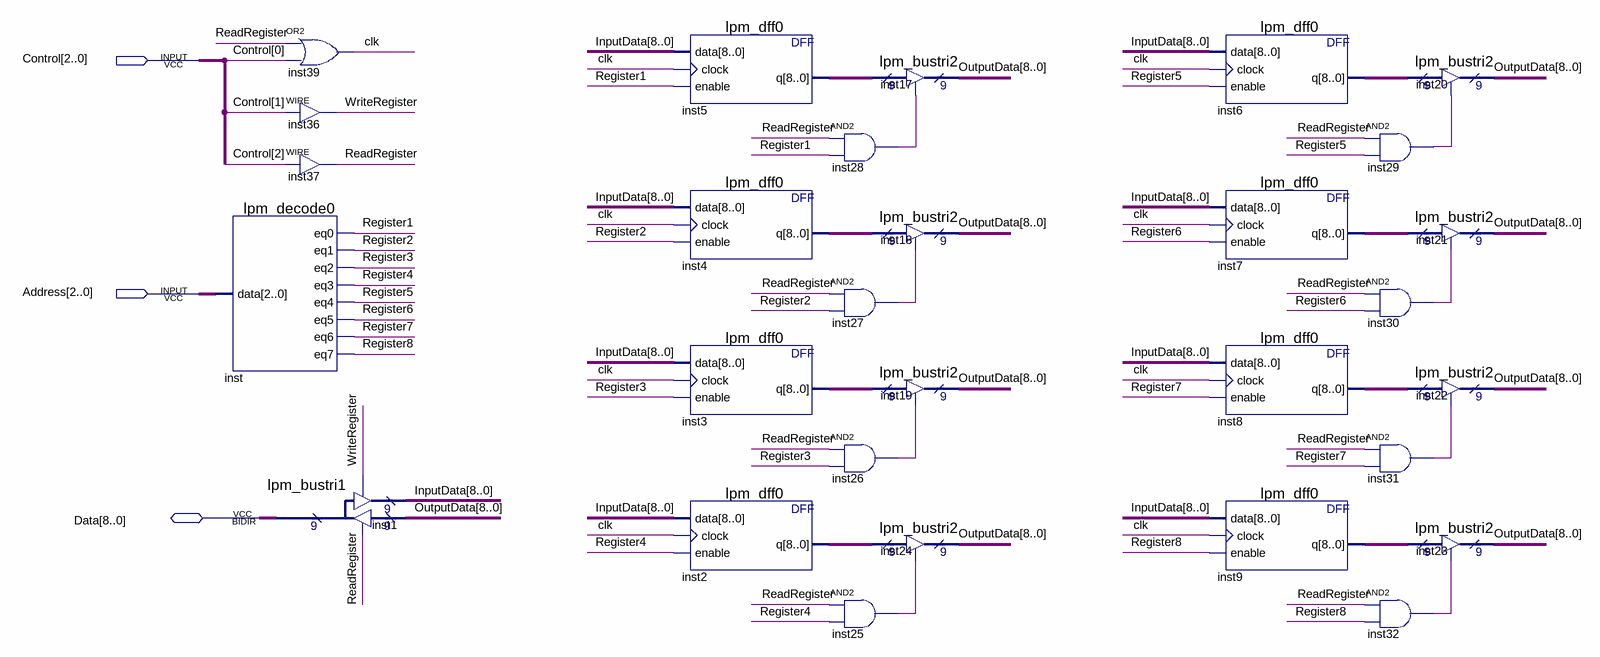
[diagram p0: schematic sheet]
// Quartus schematic POHBlock.bdf as structural Verilog: 29 symbols, 3 pins
module POHBlock (
  input  [2:0] Control,
  input  [2:0] Address,
  inout  [8:0] Data
);

  wire clk, inst25_out, inst26_out, inst27_out, inst28_out, inst29_out, inst30_out, inst31_out, inst32_out,
       ReadRegister, Register1, Register2, Register3, Register4, Register5, Register6, Register7, Register8,
       WriteRegister;
  wire [8:0] InputData, inst2_q, inst3_q, inst4_q, inst5_q, inst6_q, inst7_q, inst8_q, inst9_q, OutputData;

  lpm_decode0 inst (
    .data(Address), .eq0(Register1), .eq1(Register2), .eq2(Register3), .eq3(Register4), .eq4(Register5),
    .eq5(Register6), .eq6(Register7), .eq7(Register8));
  or inst39 (clk, ReadRegister, Control[0]);
  assign WriteRegister = Control[1];  // WIRE inst36
  assign ReadRegister = Control[2];  // WIRE inst37
  lpm_bustri1 inst1 (
    .enabledt(ReadRegister), .data(OutputData), .enabletr(WriteRegister), .result(InputData), .tridata(Data));
  lpm_dff0 inst5 (.data(InputData), .clock(clk), .enable(Register1), .q(inst5_q));
  lpm_dff0 inst4 (.data(InputData), .clock(clk), .enable(Register2), .q(inst4_q));
  lpm_dff0 inst3 (.data(InputData), .clock(clk), .enable(Register3), .q(inst3_q));
  lpm_dff0 inst2 (.data(InputData), .clock(clk), .enable(Register4), .q(inst2_q));
  and inst28 (inst28_out, ReadRegister, Register1);
  and inst27 (inst27_out, ReadRegister, Register2);
  and inst26 (inst26_out, ReadRegister, Register3);
  and inst25 (inst25_out, ReadRegister, Register4);
  lpm_bustri2 inst17 (.enabledt(inst28_out), .data(inst5_q), .tridata(OutputData));
  lpm_bustri2 inst18 (.enabledt(inst27_out), .data(inst4_q), .tridata(OutputData));
  lpm_bustri2 inst19 (.enabledt(inst26_out), .data(inst3_q), .tridata(OutputData));
  lpm_bustri2 inst24 (.enabledt(inst25_out), .data(inst2_q), .tridata(OutputData));
  lpm_dff0 inst6 (.data(InputData), .clock(clk), .enable(Register5), .q(inst6_q));
  lpm_dff0 inst7 (.data(InputData), .clock(clk), .enable(Register6), .q(inst7_q));
  lpm_dff0 inst8 (.data(InputData), .clock(clk), .enable(Register7), .q(inst8_q));
  lpm_dff0 inst9 (.data(InputData), .clock(clk), .enable(Register8), .q(inst9_q));
  lpm_bustri2 inst20 (.enabledt(inst29_out), .data(inst6_q), .tridata(OutputData));
  and inst29 (inst29_out, ReadRegister, Register5);
  lpm_bustri2 inst21 (.enabledt(inst30_out), .data(inst7_q), .tridata(OutputData));
  and inst30 (inst30_out, ReadRegister, Register6);
  lpm_bustri2 inst22 (.enabledt(inst31_out), .data(inst8_q), .tridata(OutputData));
  and inst31 (inst31_out, ReadRegister, Register7);
  lpm_bustri2 inst23 (.enabledt(inst32_out), .data(inst9_q), .tridata(OutputData));
  and inst32 (inst32_out, ReadRegister, Register8);
endmodule
